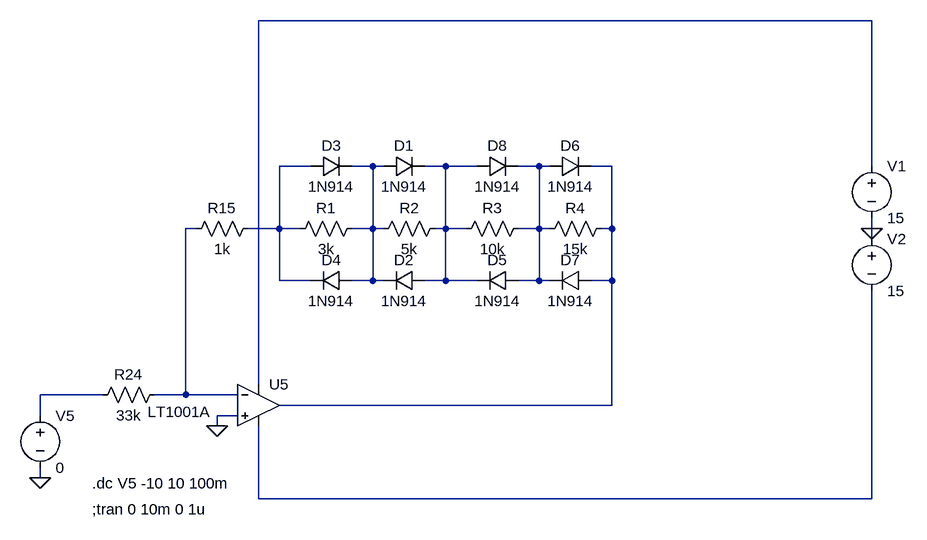
[diagram p0: schematic TriangSeno.asc]
TriangSeno.asc, the LTspice schematic file:
Version 4
SHEET 1 3400 680
WIRE 2224 -192 1280 -192
WIRE 1360 32 1312 32
WIRE 1456 32 1424 32
WIRE 1472 32 1456 32
WIRE 1568 32 1536 32
WIRE 1616 32 1568 32
WIRE 1712 32 1680 32
WIRE 1728 32 1712 32
WIRE 1824 32 1792 32
WIRE 2224 32 2224 -192
WIRE 1184 128 1168 128
WIRE 1312 128 1312 32
WIRE 1312 128 1264 128
WIRE 1344 128 1312 128
WIRE 1456 128 1456 32
WIRE 1456 128 1424 128
WIRE 1472 128 1456 128
WIRE 1568 128 1568 32
WIRE 1568 128 1552 128
WIRE 1600 128 1568 128
WIRE 1712 128 1712 32
WIRE 1712 128 1680 128
WIRE 1728 128 1712 128
WIRE 1824 128 1824 32
WIRE 1824 128 1808 128
WIRE 2224 128 2224 112
WIRE 2224 144 2224 128
WIRE 1312 208 1312 128
WIRE 1360 208 1312 208
WIRE 1456 208 1456 128
WIRE 1456 208 1424 208
WIRE 1472 208 1456 208
WIRE 1568 208 1568 128
WIRE 1568 208 1536 208
WIRE 1616 208 1568 208
WIRE 1712 208 1712 128
WIRE 1712 208 1680 208
WIRE 1728 208 1712 208
WIRE 1824 208 1824 128
WIRE 1824 208 1792 208
WIRE 1280 368 1280 -192
WIRE 1040 384 944 384
WIRE 1168 384 1168 128
WIRE 1168 384 1120 384
WIRE 1248 384 1168 384
WIRE 1824 400 1824 208
WIRE 1824 400 1312 400
WIRE 944 416 944 384
WIRE 1248 416 1216 416
WIRE 1216 432 1216 416
WIRE 944 512 944 496
WIRE 1280 544 1280 432
WIRE 2224 544 2224 224
WIRE 2224 544 1280 544
FLAG 2224 128 0
FLAG 1216 432 0
FLAG 944 512 0
SYMBOL voltage 2224 16 R0
WINDOW 123 0 0 Left 2
WINDOW 39 0 0 Left 2
SYMATTR InstName V1
SYMATTR Value 15
SYMBOL voltage 2224 128 R0
WINDOW 123 0 0 Left 2
WINDOW 39 0 0 Left 2
SYMATTR InstName V2
SYMATTR Value 15
SYMBOL Opamps\\LT1001A 1280 336 R0
WINDOW 3 -171 74 Left 2
SYMATTR InstName U5
SYMBOL res 1280 112 R90
WINDOW 0 0 56 VBottom 2
WINDOW 3 32 56 VTop 2
SYMATTR InstName R15
SYMATTR Value 1k
SYMBOL res 1136 368 R90
WINDOW 0 0 56 VBottom 2
WINDOW 3 32 56 VTop 2
SYMATTR InstName R24
SYMATTR Value 33k
SYMBOL diode 1424 192 R90
WINDOW 0 0 32 VBottom 2
WINDOW 3 32 32 VTop 2
SYMATTR InstName D4
SYMATTR Value 1N914
SYMBOL voltage 944 400 R0
WINDOW 123 0 0 Left 2
WINDOW 39 0 0 Left 2
SYMATTR InstName V5
SYMATTR Value 0
SYMBOL res 1440 112 R90
WINDOW 0 0 56 VBottom 2
WINDOW 3 32 56 VTop 2
SYMATTR InstName R1
SYMATTR Value 3k
SYMBOL res 1568 112 R90
WINDOW 0 0 56 VBottom 2
WINDOW 3 32 56 VTop 2
SYMATTR InstName R2
SYMATTR Value 5k
SYMBOL diode 1472 48 R270
WINDOW 0 32 32 VTop 2
WINDOW 3 0 32 VBottom 2
SYMATTR InstName D1
SYMATTR Value 1N914
SYMBOL diode 1536 192 R90
WINDOW 0 0 32 VBottom 2
WINDOW 3 32 32 VTop 2
SYMATTR InstName D2
SYMATTR Value 1N914
SYMBOL diode 1360 48 R270
WINDOW 0 32 32 VTop 2
WINDOW 3 0 32 VBottom 2
SYMATTR InstName D3
SYMATTR Value 1N914
SYMBOL diode 1680 192 R90
WINDOW 0 0 32 VBottom 2
WINDOW 3 32 32 VTop 2
SYMATTR InstName D5
SYMATTR Value 1N914
SYMBOL res 1696 112 R90
WINDOW 0 0 56 VBottom 2
WINDOW 3 32 56 VTop 2
SYMATTR InstName R3
SYMATTR Value 10k
SYMBOL res 1824 112 R90
WINDOW 0 0 56 VBottom 2
WINDOW 3 32 56 VTop 2
SYMATTR InstName R4
SYMATTR Value 15k
SYMBOL diode 1728 48 R270
WINDOW 0 32 32 VTop 2
WINDOW 3 0 32 VBottom 2
SYMATTR InstName D6
SYMATTR Value 1N914
SYMBOL diode 1792 192 R90
WINDOW 0 0 32 VBottom 2
WINDOW 3 32 32 VTop 2
SYMATTR InstName D7
SYMATTR Value 1N914
SYMBOL diode 1616 48 R270
WINDOW 0 32 32 VTop 2
WINDOW 3 0 32 VBottom 2
SYMATTR InstName D8
SYMATTR Value 1N914
TEXT 1024 520 Left 2 !.dc V5 -10 10 100m
TEXT 1024 560 Left 2 !;tran 0 10m 0 1u

The netlist it stands for:
* TriangSeno.asc
V1 N001 0 15
V2 0 N009 15
XU5 0 N007 N001 N009 N006 LT1001  ; LT1001A, pins In+ In- V+ V- OUT
R15 N002 N007 1k
R24 N007 N008 33k
D4 N003 N002 1N914
V5 N008 0 0
R1 N003 N002 3k
R2 N004 N003 5k
D1 N003 N004 1N914
D2 N004 N003 1N914
D3 N002 N003 1N914
D5 N005 N004 1N914
R3 N005 N004 10k
R4 N006 N005 15k
D6 N005 N006 1N914
D7 N006 N005 1N914
D8 N004 N005 1N914
.model D D
.lib standard.dio
.dc V5 -10 10 100m
;tran 0 10m 0 1u
.lib LTC.lib
.backanno
.end